# EAGLE design BLE v1.0 prater mod (EAGLE 6.5.0)
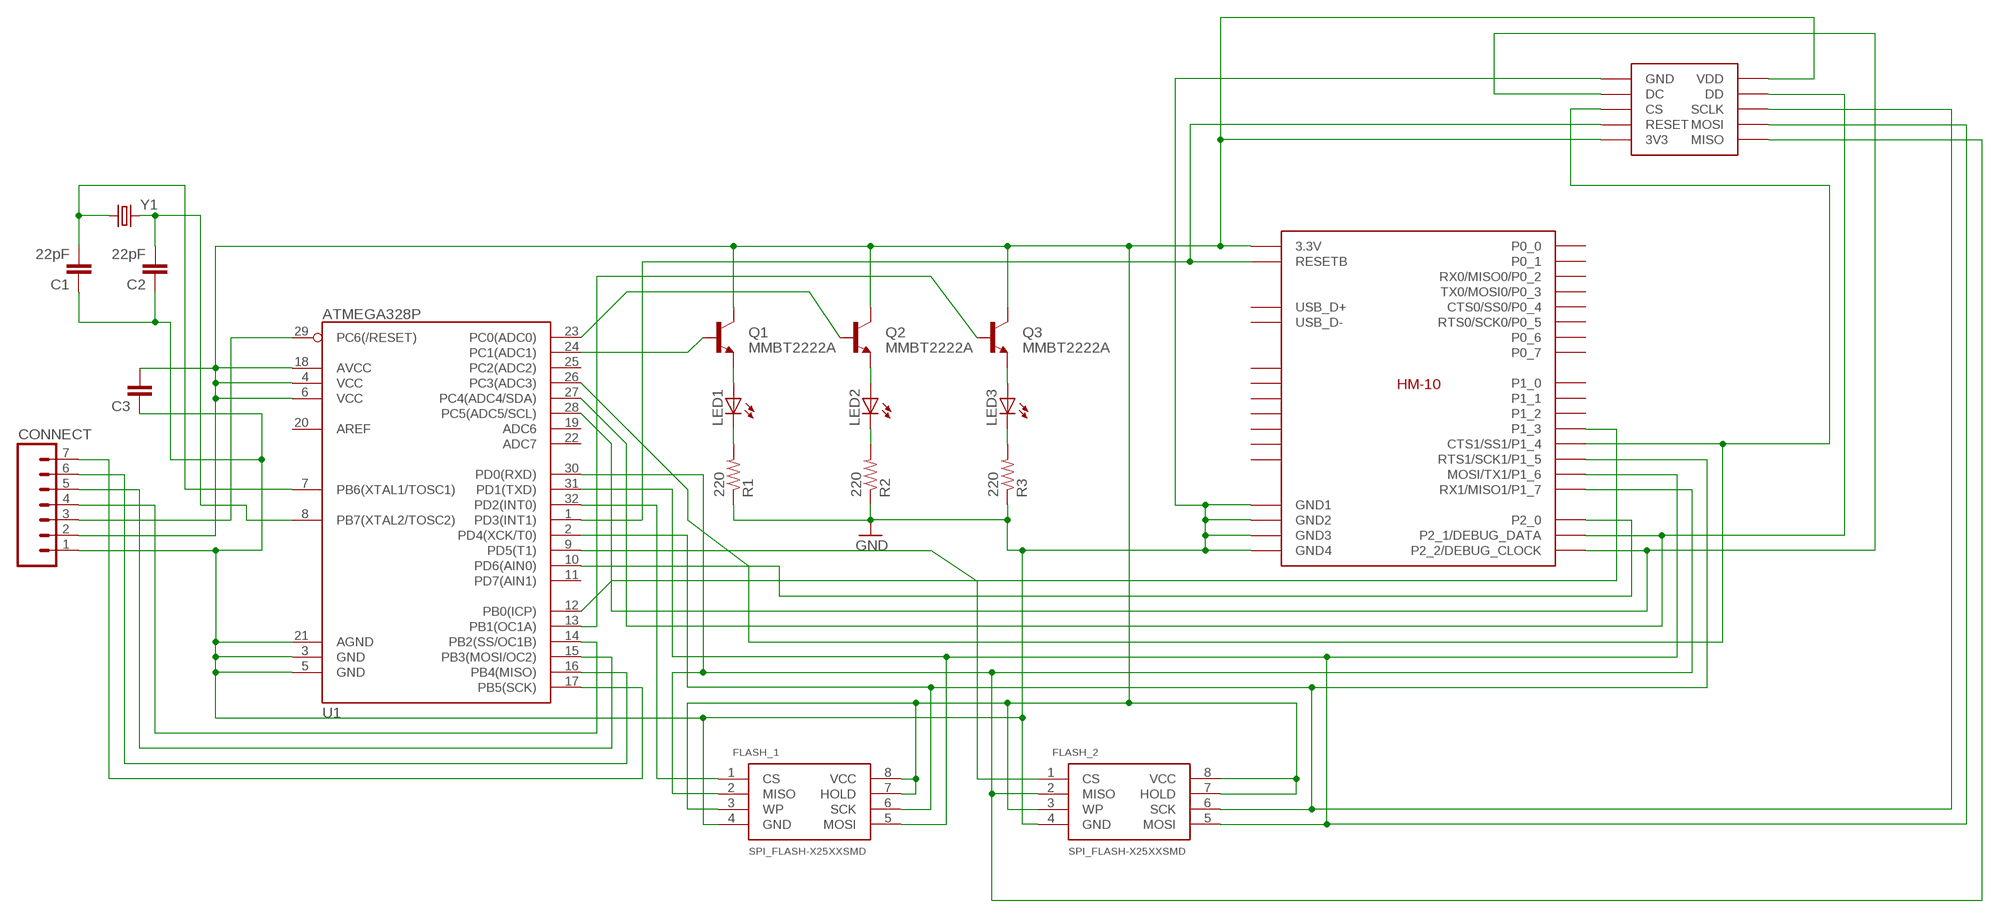
[diagram p0: schematic, sheet 1]

## Parts
C1  22pF  22PF-50V-5%(0603)  [0603-CAP]
C2  22pF  22PF-50V-5%(0603)  [0603-CAP]
C3  CAP1210  [1210]
CONNECT  M07  [1X07]
FLASH_1  SPI_FLASH-X25XXSMD  [SO08]
FLASH_2  SPI_FLASH-X25XXSMD  [SO08]
LED1  LED0603  [LED-0603]
LED2  LED0603  [LED-0603]
LED3  LED0603  [LED-0603]
Q1  MMBT2222A  TRANSISTOR_NPNMMBT2222A  [SOT23]
Q2  MMBT2222A  TRANSISTOR_NPNMMBT2222A  [SOT23]
Q3  MMBT2222A  TRANSISTOR_NPNMMBT2222A  [SOT23]
R1  220  R-US_M0805  [M0805]
R2  220  R-US_M0805  [M0805]
R3  220  R-US_M0805  [M0805]
U1  ATMEGA328P  ATMEGA328_SMT  [TQFP32-08]
U$1  BLE-HM-10  [BLE-HM-10]
U$4  2X5-.127-HEADER  [2X5-.127-HEADER]
Y1  CRYSTALHC49US  [HC49US]

## Nets
3V3: C3.2 CONNECT.2 FLASH_1.3(WP) FLASH_1.7(HOLD) FLASH_1.8(VCC) FLASH_2.3(WP) FLASH_2.7(HOLD) FLASH_2.8(VCC) Q1.3(C) Q2.3(C) Q3.3(C) U1.4(VCC) U1.6(VCC) U1.18(AVCC) U$1.3.3V U$4.3V3 U$4.VDD
GND: C1.1 C2.1 C3.1 CONNECT.1 FLASH_1.4(GND) FLASH_2.4(GND) R1.1 R2.1 R3.1 U1.3(GND) U1.5(GND) U1.21(AGND) U$1.GND1 U$1.GND2 U$1.GND3 U$1.GND4 U$4.GND
N$2: LED3.A Q3.2(E)
N$4: LED1.A Q1.2(E)
N$5: FLASH_1.6(SCK) FLASH_2.6(SCK) U1.2(PD4(XCK/T0)) U$1.UART_RTS(RTS1/SCK1/P1_5) U$4.SCLK
N$7: FLASH_1.2(MISO) FLASH_2.2(MISO) U1.30(PD0(RXD)) U$1.UART_RX(RX1/MISO1/P1_7) U$4.MISO
N$8: LED1.C R1.2
N$9: FLASH_1.5(MOSI) FLASH_2.5(MOSI) U1.31(PD1(TXD)) U$1.UART_TX(MOSI/TX1/P1_6) U$4.MOSI
N$10: CONNECT.6 U1.16(PB4(MISO))
N$11: LED2.A Q2.2(E)
N$14: LED3.C R3.2
N$15: FLASH_2.1(CS) U1.9(PD5(T1))
N$17: C2.2 U1.8(PB7(XTAL2/TOSC2)) Y1.2
N$18: Q2.1(B) U1.23(PC0(ADC0))
N$19: Q3.1(B) U1.13(PB1(OC1A))
N$20: FLASH_1.1(CS) U1.32(PD2(INT0))
N$21: U1.26(PC3(ADC3)) U$1.UART_CTS(CTS1/SS1/P1_4) U$4.CS
N$22: CONNECT.7 U1.17(PB5(SCK))
N$23: CONNECT.5 U1.15(PB3(MOSI/OC2))
N$25: U1.1(PD3(INT1)) U$1.RESET(RESETB) U$4.RESET
N$26: LED2.C R2.2
N$28: U1.27(PC4(ADC4/SDA)) U$1.PCM_SYNC(P2_1/DEBUG_DATA) U$4.DD
N$29: U1.28(PC5(ADC5/SCL)) U$1.PCM_IN(P2_2/DEBUG_CLOCK) U$4.DC
N$31: CONNECT.4 U1.14(PB2(SS/OC1B))
N$32: CONNECT.3 U1.29(PC6(/RESET))
N$42: C1.2 U1.7(PB6(XTAL1/TOSC1)) Y1.1
N$44: Q1.1(B) U1.24(PC1(ADC1))
N$56: U1.10(PD6(AIN0)) U$1.AIO0(P2_0)
N$57: U1.12(PB0(ICP)) U$1.PIO0(P1_3)
Unconnected: U1.11(PD7(AIN1)) U1.19(ADC6) U1.20(AREF) U1.22(ADC7) U1.25(PC2(ADC2)) U$1.AIO1 U$1.PCM_CLK U$1.PCM_OUT U$1.PIO1(P1_2) U$1.PIO2(P1_1) U$1.PIO3(P1_0) U$1.PIO4(P0_7) U$1.PIO5(P0_6) U$1.PIO6(RTS0/SCK0/P0_5) U$1.PIO7(CTS0/SS0/P0_4) U$1.PIO8(TX0/MOSI0/P0_3) U$1.PIO9(RX0/MISO0/P0_2) U$1.PIO10(P0_1) U$1.PIO11(P0_0) U$1.SPI_CLK U$1.SPI_CSB U$1.SPI_MISO U$1.SPI_MOSI U$1.USB_D+ U$1.USB_D-

## Library data of the parts
C1 C2 = SparkFun-Capacitors:22PF-50V-5%(0603): CAP-07876; PROD_ID: CAP-07876
C3 = SparkFun-Capacitors:CAP: Capacitor Standard 0603 ceramic capacitor, and 0.1" leaded capacitor.
CONNECT = SparkFun-Connectors:M07: Header 7 Standard 7-pin 0.1" header. Use with straight break away headers (SKU : PRT-00116), right angle break away headers (PRT-00553), swiss pins (PRT-00743), machine pins (PRT-00117), and female headers (PRT-00115). NOTES ON THE VARIANTS LOCK and LOCK_LONGPADS... This footprint was designed to help hold the alignment of a through-hole component (i.e. 7-pin header) while soldering it into place. You may notice that each hole has been shifted either up or down by 0.005 of an inch from it's more standard position (which is usually a perfectly straight line). This slight alteration caused the pins (the squares in the middle) to touch the edges of the holes. Because they are alternating, it causes a "brace" to hold the header in place. 0.005 has proven to be the perfect amount of "off-center" position when using our standard breakaway headers. Although looks a little odd when you look at the bare footprint, once you have a header in there, the alteration is very hard to notice. Also, if you push a header all the way into place, it is covered up entirely on the bottom side. This idea of altering the position of holes to aid alignment will be further integrated into the Sparkfun Library for other footprints. It can help hold any component with 3 or more connection pins.
FLASH_1 FLASH_2 = SparkFun-DigitalIC:SPI_FLASH-X25XX: 8pin SPI Flash series x25xx. Works with devices like W25X32 and BR25L32
LED1-LED3 = SparkFun:LED: LEDs Standard schematic elements and footprints for 5mm, 3mm, 1206, and 0603 sized LEDs. 5mm - Spark Fun Electronics SKU : COM-00529 (and others)
Q1-Q3 = SparkFun-DiscreteSemi:TRANSISTOR_NPN: Generic NPN BJT MMBT2222A - TRANS-08049 (SOT-23, 1A 40V) MPSA42 - TRANS-09116 (SOT-23, 500mA 300V) MMBT5088LT1G - TRANS-11160 (SOT-23, 50 mA 30V); PROD_ID: TRANS-08049
R1-R3 = resistor:R-US_: RESISTOR, American symbol
U1 = SparkFun-DigitalIC:ATMEGA328_SMT: 32-Pin Atmega328 part Commonly used on Arduino compatible boards Available in QFP and QFN packages TQFP is IC-09069 QFN is non-stock; PROD_ID: IC-09069
U$1 = prater:BLE-HM-10
U$4 = prater:2X5-.127-HEADER
Y1 = SparkFun-FreqCtrl:CRYSTAL: Various standard crystals. Proven footprints. Spark Fun Electronics SKU : COM-00534

## Board
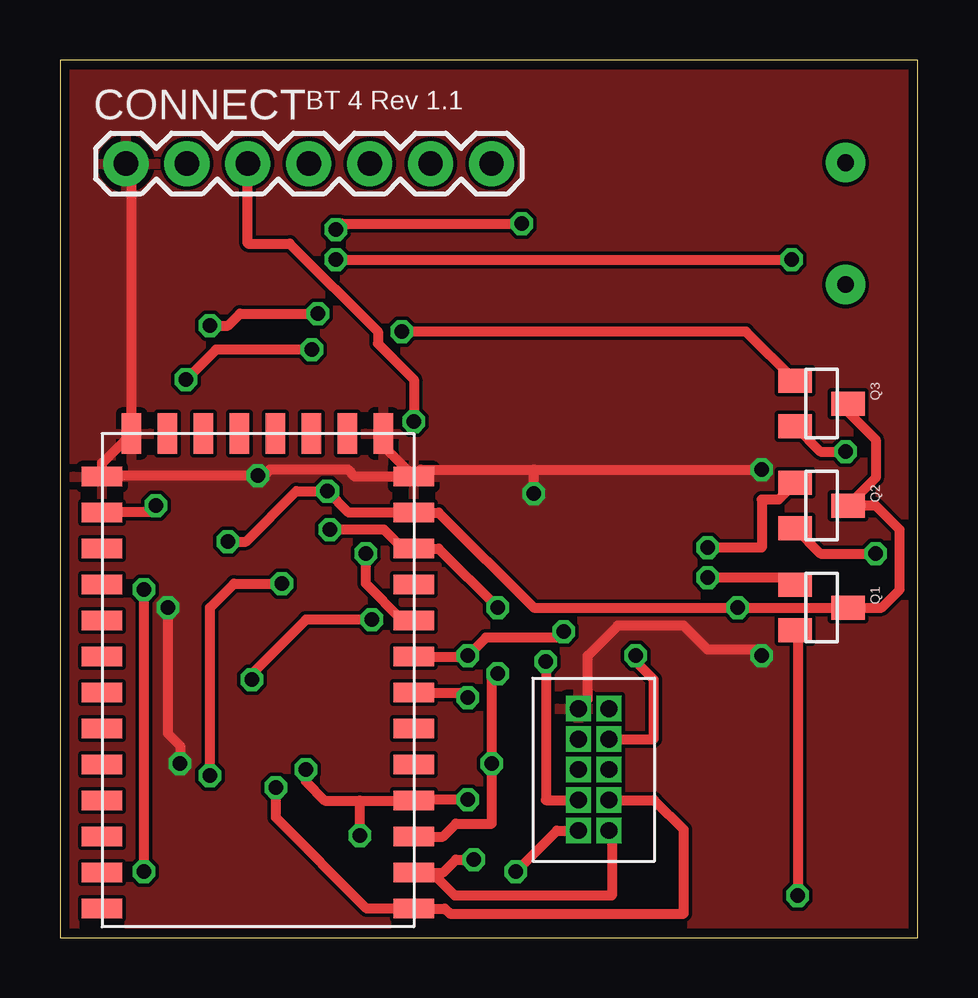
[diagram p1: board, top side]
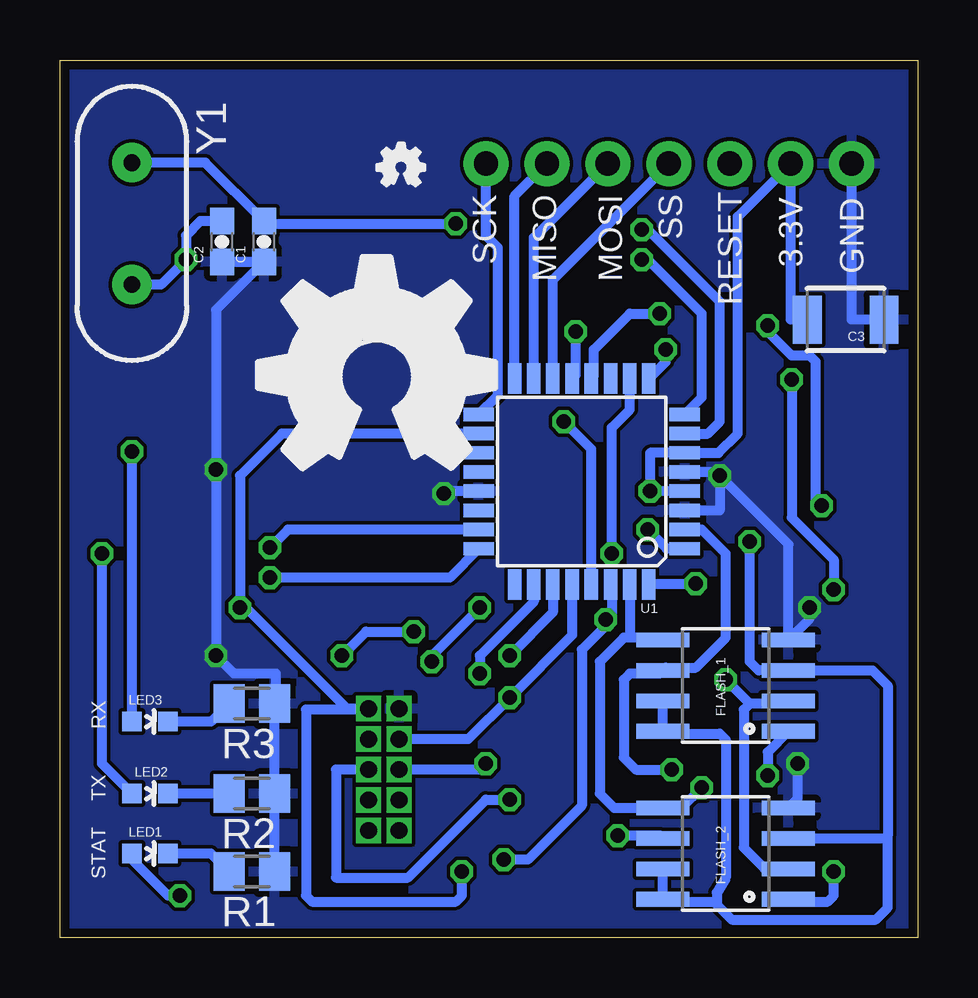
[diagram p2: board, bottom side, seen from below]

Size 35.75 x 36.57 mm. Coordinates in mm from the lower left corner, seen from the top.
Outline: 0,0 35.75,0 35.75,36.57 0,36.57 0,0
Copper layers (1*16): Top 0.0356mm / dielectric 1.5011mm / Bottom 0.0356mm
Design rules "LaenPCBOrder *": minimum track width 6mil, minimum drill 13mil, track to track 6mil, track to pad 6mil, pad to pad 6mil, via to via 6mil, smd to smd 6mil, copper to edge 15mil, drill to drill 6mil, minimum pad ring 7mil, minimum via ring 7mil, stop-mask expansion 3mil, vias tented up to drill 97mil, thermal gap 10mil

### Footprints (pad centres in the part's own frame; a part is rotated, then mirrored left to right if it is on the bottom)
0603-CAP = smd 1.1 x 1: 1 -0.85,0; 2 0.85,0
1210 = smd 1.2 x 2: 1 -1.6,0; 2 1.6,0
1X07 = drill 1.016 pad 1.88: 1 0,0; 2 2.54,0; 3 5.08,0; 4 7.62,0; 5 10.16,0; 6 12.7,0; 7 15.24,0
SO08 = smd 0.61 x 2.21: 1 -1.905,-2.616; 2 -0.635,-2.616; 3 0.635,-2.616; 4 1.905,-2.616; 5 1.905,2.616; 6 0.635,2.616; 7 -0.635,2.616; 8 -1.905,2.616
LED-0603 = smd 0.8 x 0.8: A 0,-0.75; C 0,0.75
SOT23 = smd 1 x 1.4: 1 -0.95,-1.1; 2 0.95,-1.1; 3 0,1.1
M0805 = smd 1.3 x 1.6: 1 -0.95,0; 2 0.95,0
TQFP32-08 = smd 1.27 x 0.559: 1 -4.293,2.8; 2 -4.293,2; 3 -4.293,1.2; 4 -4.293,0.4; 5 -4.293,-0.4; 6 -4.293,-1.2; 7 -4.293,-2; 8 -4.293,-2.8; 17 4.293,-2.8; 18 4.293,-2; 19 4.293,-1.2; 20 4.293,-0.4; 21 4.293,0.4; 22 4.293,1.2; 23 4.293,2; 24 4.293,2.8 | smd 0.559 x 1.27: 9 -2.8,-4.293; 10 -2,-4.293; 11 -1.2,-4.293; 12 -0.4,-4.293; 13 0.4,-4.293; 14 1.2,-4.293; 15 2,-4.293; 16 2.8,-4.293; 25 2.8,4.293; 26 2,4.293; 27 1.2,4.293; 28 0.4,4.293; 29 -0.4,4.293; 30 -1.2,4.293; 31 -2,4.293; 32 -2.8,4.293
BLE-HM-10 = smd 1.676 x 0.813: 3.3V 0,3.29; AIO0 0,7.79; AIO1 0,6.29; GND1 0,1.79; GND4 13,1.79; PCM_CLK 0,13.79; PCM_IN 0,10.79; PCM_OUT 0,12.29; PCM_SYNC 0,9.29; PIO0 13,3.29; PIO1 13,4.79; PIO2 13,6.29; PIO3 13,7.79; PIO4 13,9.29; PIO5 13,10.79; PIO6 13,12.29; PIO7 13,13.79; PIO8 13,15.29; PIO9 13,16.79; PIO10 13,18.29; PIO11 13,19.79; RESET 0,4.79; UART_CTS 0,16.79; UART_RTS 0,15.29; UART_RX 0,18.29; UART_TX 0,19.79 | smd 0.813 x 1.676: GND2 1.27,0; GND3 11.77,0; SPI_CLK 8.77,0; SPI_CSB 4.27,0; SPI_MISO 7.27,0; SPI_MOSI 5.77,0; USB_D+ 10.27,0; USB_D- 2.77,0
2X5-.127-HEADER = drill 0.7 pad 0.889 square: 3V3 -0.635,-2.54; CS -0.635,0; DC -0.635,1.27; DD 0.635,1.27; GND -0.635,2.54; MISO 0.635,-2.54; MOSI 0.635,-1.27; RESET -0.635,-1.27; SCLK 0.635,0; VDD 0.635,2.54
HC49US = drill 0.7 pad 1.651: 1 -2.54,0; 2 2.54,0

### Placement (x,y rotation side)
C1  27.25,29 90 bottom
C2  29,29 90 bottom
C3  3,25.75 180 bottom
CONNECT  2.75,32.25 0 top
FLASH_1  8,10.5 90 bottom
FLASH_2  8,3.5 90 bottom
LED1  32,3.5 270 bottom
LED2  32,6 270 bottom
LED3  32,9 270 bottom
Q1  31.75,13.75 270 top
Q2  31.75,18 270 top
Q3  31.75,22.25 270 top
R1  27.75,2.75 180 bottom
R2  27.75,6 180 bottom
R3  27.75,9.75 180 bottom
U1  14,19 180 bottom
U$1  14.75,21 180 top
U$2  [OSHW_FILLX350_NOTEXT]  27.51,19.52 0 bottom
U$3  [OSHW_FILLX70_NOTEXT]  22.52,31.32 0 bottom
U$4  22.25,7 0 top
Y1  32.75,29.75 270 bottom

### Tracks (layer width: path | path; a pad name or v marks a point on that pad's centre or on a via)
3V3  (via drill 0.6)
  Top 0.406: Q3.3 32.85,21.9 34,20.75 34,19.15 Q2.3 34,18 35,17 35,14.5 34.25,13.75 Q1.3 v28.25,13.75 19.75,13.75 15.79,17.71 U$1.3.3V 12.04,17.71 v11.15,18.6 9.85,18.6 7.75,16.5 v7,16.5 | v19,2.75 20.71,4.46 U$4.3V3
  Bottom 0.406: U1.4 v11.15,18.6 11.15,20.2 U1.6 8.3,20.2 7.5,21 7.5,30.04 CONNECT.2 5.29,25.75 C3.2 | 1.25,4.25 1.25,10.5 1.89,11.13 FLASH_1.3 6.63,11.13 7,11.5 v7,16.5 | 8.38,1.38 8.5,1.5 10.52,1.5 FLASH_2.8 FLASH_2.7 | 8.38,1.38 7.75,0.75 1.75,0.75 1.25,1.25 1.25,4.25 | 8.38,1.38 8.38,1.88 8,2.5 8,8.25 8.25,8.5 10.52,8.5 FLASH_1.8 FLASH_1.7 | FLASH_2.3 1.36,4.13 1.25,4.25 | U1.18 26.5,21 28.25,19.25 v28.25,13.75 28,13.75 23.79,9.54 U$4.VDD 22.93,9.5 25.5,9.5 25.5,1.75 25.25,1.5 19.25,1.5 19,1.75 v19,2.75
GND  (via drill 0.6)
  Top 0.406: CONNECT.1 2.98,32.02 U$1.GND3 1.75,19.77 U$1.GND4 1.79,19.25 v8.25,19.25 8.5,19.25 8.75,19.5 12,19.5 12.29,19.21 U$1.GND1 | U$1.GND2 13.48,20.48 U$1.GND1 | v5,7.25 5,8 4.5,8.5 v4.5,13.75 | U$1.GND1 15.04,19.5 19.75,19.5 | 19.75,19.5 v29.25,19.5 | v19.75,18.5 19.75,19.5 | U$4.GND 22,9.93 22,11.75 23.25,13 26,13 27,12 29,12 v29.25,11.75
  Bottom 0.406: R1.1 R2.1 R3.1 26.75,9.8 26.75,11 28.5,11 v29.25,11.75 v29.25,19.5 29.25,26.15 C1.1 C2.1 | U1.3 8.25,17.8 v8.25,19.25 | U1.5 8.25,19.4 v8.25,19.25 | v8.25,19.25 5.38,16.38 FLASH_1.4 4.5,13.29 v4.5,13.75 | FLASH_2.4 5,5.79 v5,7.25 | C3.1 2.75,25.75 CONNECT.1 | U1.21 19.65,18.6 v19.75,18.5
  pour Bottom: -0.01,0.17 35.89,0.17 35.89,36.59 -0.01,36.59
  pour Top: 0,36.5 0,0.18 35.75,0.18 35.75,36.5
N$2  (via drill 0.6)
  Top 0.406: Q3.2 31.7,20.25 v32.75,20.25
  Bottom 0.406: LED3.A v32.75,20.25
N$4  (via drill 0.6)
  Top 0.406: Q1.2 30.75,12.7 v30.75,1.75
  Bottom 0.406: v30.75,1.75 31.25,1.75 32.75,3.25 LED1.A
N$5  (via drill 0.6)
  Top 0.406: v10.25,7 10.25,6.5 11.04,5.71 12.5,5.71 | 12.5,5.71 U$1.UART_RTS arc-90 14.79,5.75 v17,5.75 | v12.5,4.25 12.5,5.71
  Bottom 0.406: v10.25,7 11.75,7 12.25,7.5 12.25,10.75 12,11 10.75,11 FLASH_1.6 10.5,11.25 9.25,11.25 8,12.5 8,16 9,17 U1.2 | FLASH_2.6 10.73,4.25 v12.5,4.25 | U$4.SCLK 24.25,7 24.25,2.5 21.25,2.5 18,5.75 v17,5.75
N$7  (via drill 0.6)
  Top 0.406: U$1.UART_RX 15.5,2.71 | 15.5,2.71 15.96,2.71 16.5,3.25 v17.25,3.25 | v13,13.25 10.25,13.25 8,11 v8,10.75 | U$4.MISO 23,4.46 23,1.75 16.46,1.75 15.5,2.71
  Bottom 0.406: FLASH_1.2 5.5,9.75 7,9.75 | 7,9.75 7.25,9.5 7.25,3.75 6.37,2.87 FLASH_2.2 | U1.30 12.75,14.66 12.75,13.5 v13,13.25 13,13 14,12 14,5.5 16.25,3.25 v17.25,3.25 | 7,9.75 v8,10.75
N$8
  Bottom 0.406: R1.2 29.45,3.5 LED1.C
N$9  (via drill 0.6)
  Top 0.406: v9,6.25 9,5 12.79,1.21 U$1.UART_TX 16.04,1.21 16.25,1 26,1 26,4.5 24.77,5.73 U$4.MOSI
  Bottom 0.406: FLASH_1.5 10.71,12.5 12,12.5 | 12,12.5 12.25,12.5 13.25,11.5 13.25,6 12.65,5.41 FLASH_2.5 9.85,5.41 v9,6.25 | U1.31 12,12.5
N$10
  Bottom 0.406: U1.16 16.8,30.9 CONNECT.6
N$11  (via drill 0.6)
  Top 0.406: Q2.2 31.7,16 v34,16
  Bottom 0.406: LED2.A 34,7.25 v34,16
N$14
  Bottom 0.406: R3.2 29.45,9 LED3.C
N$15  (via drill 0.6)
  Top 0.406: v3.5,2.75 v3.5,14.5 | v10.5,24.5 6.5,24.5 v5.25,23.25
  Bottom 0.406: FLASH_2.1 5.29,1.5 3.75,1.5 3.5,1.75 v3.5,2.75 | U1.9 10.5,23.99 v10.5,24.5 | v5.25,23.25 5.25,17.5 3.5,15.75 v3.5,14.5
N$17  (via drill 0.6)
  Top 0.406: v11.5,28.25 v30.5,28.25
  Bottom 0.406: U1.8 9,22.51 9,26 11.25,28.25 v11.5,28.25 | Y1.2 31.54,27.21 v30.5,28.25 30.5,29.25 29.9,29.85 C2.2
N$18  (via drill 0.6)
  Top 0.406: Q2.1 29.95,18.25 29.25,18.25 29.25,16.25 v27,16.25
  Bottom 0.406: U1.23 26.25,17 v27,16.25
N$19  (via drill 0.6)
  Top 0.406: Q3.1 28.6,25.25 v14.25,25.25
  Bottom 0.406: U1.13 14.25,23.44 v14.25,25.25
N$20  (via drill 0.6)
  Top 0.406: v6.25,6.75 6.25,13.75 7.25,14.75 v9.25,14.75
  Bottom 0.406: FLASH_1.1 6.25,7.73 v6.25,6.75 | U1.32 11.16,14.75 v9.25,14.75
N$21  (via drill 0.6)
  Top 0.406: U$1.UART_CTS 15.96,4.21 16.5,4.75 18,4.75 v18,7.25 18,10.75 v18.25,11
  Bottom 0.406: U1.26 16,14 18.25,11.75 v18.25,11 | v18,7.25 18.25,7 U$4.CS
N$22
  Bottom 0.406: U1.17 17.5,22.59 17.5,28.75 17.99,29.24 CONNECT.7
N$23
  Bottom 0.406: U1.15 16,29.16 CONNECT.5
N$25  (via drill 0.6)
  Top 0.406: v11.25,17 13.5,17 14.25,16.25 14.71,16.25 U$1.RESET 15.79,16.21 v18.25,13.75 | v20.25,11.5 20.25,5.73 U$4.RESET
  Bottom 0.406: U1.1 10.45,16.2 v11.25,17 | v18.25,13.75 20.25,11.75 v20.25,11.5
N$26
  Bottom 0.406: R2.2 LED2.C
N$28  (via drill 0.6)
  Top 0.406: U$1.PCM_SYNC 16.96,11.71 v17,11.75 17.75,12.5 20.75,12.5 v21,12.75 | U$4.DD 24.75,8.27 24.75,10.75 24,11.5 v24,11.75
  Bottom 0.406: U1.27 15.2,13.55 v17,11.75 | v24,11.75 23,12.75 v21,12.75
N$29  (via drill 0.6)
  Top 0.406: U$1.PCM_IN 16.79,10.21 v17,10
  Bottom 0.406: U1.28 14.4,12.6 v17,10 18.73,8.27 U$4.DC
N$31
  Bottom 0.406: U1.14 15.2,27.42 CONNECT.4
N$32  (via drill 0.6)
  Top 0.406: CONNECT.3 7.83,28.92 9.58,28.92 13.25,25.25 13.25,24.75 14.75,23.25 v14.75,21.5
  Bottom 0.406: U1.29 13.6,20.35 v14.75,21.5
N$42  (via drill 0.6)
  Top 0.406: v11.5,29.5 11.75,29.75 v19.25,29.75
  Bottom 0.406: Y1.1 29.69,32.29 C1.2 27.15,29.75 v19.25,29.75 | U1.7 8.75,21 8.25,21.5 8.25,26.5 11.25,29.5 v11.5,29.5
N$44  (via drill 0.6)
  Top 0.406: Q1.1 30.35,15 v27,15
  Bottom 0.406: U1.24 19.49,15 v27,15
N$56  (via drill 0.6)
  Top 0.406: U$1.AIO0 14.29,13.21 12.75,14.75 v12.75,16
  Bottom 0.406: v12.75,16 12.75,21.25 12,22 U1.10
N$57  (via drill 0.6)
  Top 0.406: U$1.PIO0 1.79,17.75 3.75,17.75 v4,18 | v6.25,25.5 7,25.5 7.5,26 v10.75,26
  Bottom 0.406: v4,18 4.25,18.25 4.25,24 4.5,24.25 5.25,24.25 6.25,25.25 v6.25,25.5 | U1.12 13.5,23.39 13.5,24.5 12,26 v10.75,26

### Text on the board
tNames: BT 4 Rev 1.1
bNames: GND | 3.3V | RESET | SS | MOSI | MISO | SCK | RX | TX | STAT